# Altium schematic sheet LMR33630.SchDoc
size A; SheetNumber: 1; SheetTotal: 1
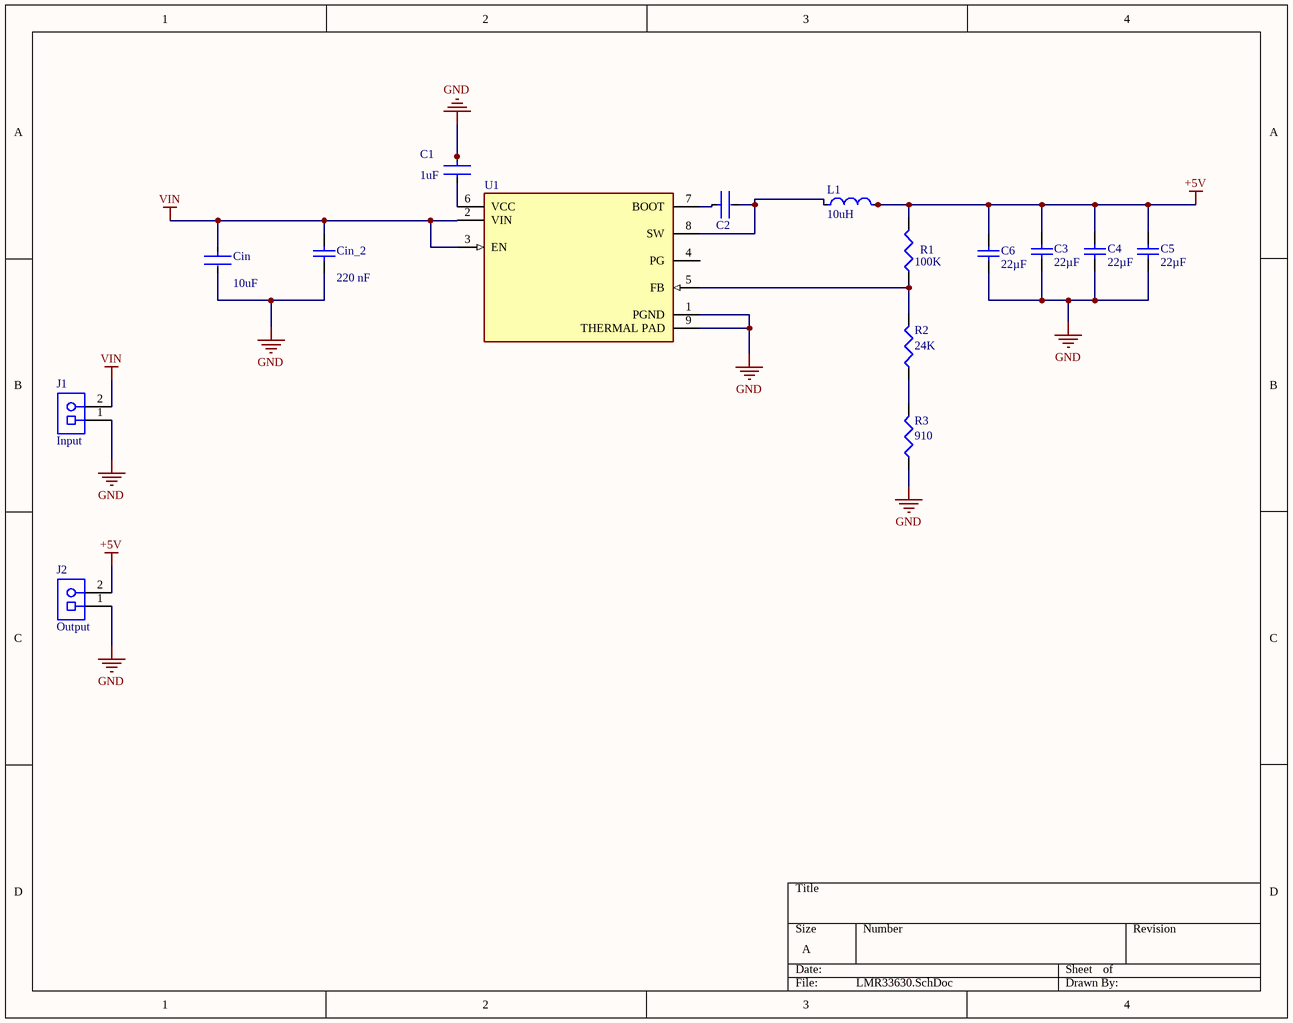
[diagram p0: LMR33630.SchDoc]

## Parts
C1  Capacitance: 1uF  [FP-CL31-IPC_B]  (hidden comment: CL31B105KBHNNNE)
C2  CC0603KRX7R9BB104  [FP-CC0603-DA-MFG]  (value not drawn)
C3  Capacitance: 22µF  [CAPC2013X140X45LL15T25]  (hidden comment: CL21A226MAQNNNE)
C4  Capacitance: 22µF  [CAPC2013X140X45LL15T25]  (hidden comment: CL21A226MAQNNNE)
C5  Capacitance: 22µF  [CAPC2013X140X45LL15T25]  (hidden comment: CL21A226MAQNNNE)
C6  Capacitance: 22µF  [CAPC2013X140X45LL15T25]  (hidden comment: CL21A226MAQNNNE)
Cin  value 10uF  [FP-CL31B106KBHNNNE-MFG]  (hidden comment: CL31B106KBHNNNE)
Cin_2  value 220 nF  [Cap_1206_220nF]  (hidden comment: 1206B224K500NT)
J1  Input  [PHOE-1729128-2_V]
J2  Output  [PHOE-1729128-2_V]
L1  Inductance: 10uH  [FP-IHLP-5050FD-FP_2_945x4-MFG]  (hidden comment: IHLP5050FDER100M01)
R1  value 100K  [J1-0603]  (hidden comment: 0603WAF1003T5E)
R2  value 24K  [Resistor_0603_910Ohm]  (hidden comment: 0603WAF2402T5E)
R3  value 910  [Resistor_0603_910Ohm]  (hidden comment: 0603WAF9100T5E)
U1  LMR33630ADDAR  [FP-DDA0008J-IPC_B]  (value not drawn)

## Nets
+5V: C3.2 C4.2 C5.2 C6.1 J2.2 L1.2 R1.2
GND: C1.1 C3.1 C4.1 C5.1 C6.2 Cin.2 Cin_2.1 J1.1 J2.1 R3.1 U1.1(PGND) U1.9(THERMAL_PAD)
VIN: Cin.1 Cin_2.2 J1.2 U1.2(VIN) U1.3(EN)
NetC1_2: C1.2 U1.6(VCC)
NetC2_1: C2.1 U1.7(BOOT)
NetC2_2: C2.2 L1.1 U1.8(SW)
NetR1_1: R1.1 R2.2 U1.5(FB)
NetR2_1: R2.1 R3.2

Not connected (* = marked no-connect by the designer): U1 4(PG)

## Library data of the parts
C1 = CMP-13271-001662-1: Cap Ceramic 1uF 50V X7R ±10% SMD 1206 +125°C Embossed T/R; Manufacturer: Samsung; Case Code (Metric): 3216; Packaging: Tape and Reel; Depth: 1.6mm; Max Operating Temperature: 125°C; Length: 3.2mm; Contact Plating: Tin; Voltage Rating (DC): 50V; Radiation Hardening: No; Min Operating Temperature: -55°C; Dielectric: X7R; Voltage: 50V; Lead Free: Lead Free; Package Quantity: 1; Material: Ceramic; Thickness: 0.071inch; Width: 0.063inch; Voltage Rating: 50V; Case Code (Imperial): 1206; Mount: Surface Mount; Case/Package: 1206; Tolerance: 10%; Height: 1.6mm; #LCSC: C1848; Manufacturer Part Number: CL31B105KBHNNNE
C2 = CMP-2100-03601-2: CAP CER 0.1UF 50V X7R 0603; Manufacturer: YAGEO; Material: Ceramic; Capacitance: 100 nF; Temperature Coefficient: 15%; Tolerance: 0.1; Value: 100 nF; Height: 0.9mm; Voltage: 50 V; ComponentLink2Description: Datasheet; Device Class L2: Capacitors; Temperature Range High: +125°C; Category: Cap; Footprint Url: http://www.yageo.com/exep/pages/download/literatures/UPY-C_GEN_24.pdf; ComponentLink2URL: http://www.yageo.com/documents/recent/UPY-GPHC_X7R_6.3V-to-50V_18.pdf; Package: CC0603-DA; Temperature: -55°C to +125°C; Voltage Rating: 50 V; Temperature Characteristic: X7R; Device Class L1: Passive Components; Temperature Range Low: -55°C; Manufacturer Part Number: CC0603KRX7R9BB104; RoHS: TRUE; Automotive: No; Device Class L3: Ceramic Capacitors; Octopart: https://octopart.com/cc0603krx7r9bb104-yageo-42244635; Mouser Description: Multilayer Ceramic Capacitor, CC Series, 0.1 - F, - 10%, X7R, 50 V, 0603 [1608 Metric]; Lead Free: Yes; Digikey Description: CAP CER 0.1UF 50V X7R 0603; #LCSC: C14663
C3-C6 = CMP-2000-06104-1: Multi-layer Ceramic Capacitor, 22 uF, -55 to 85 degC, 2-Pin SMD (0805), RoHS, Tape and Reel; Manufacturer: Samsung Electro-Mechanics; Voltage - Rated: 25V; Other Names: 1276-2908-2; Featured Product: Multi-LayerCeramicCapacitors; Product Training Modules: HighCapMLCCFamily; Temperature Coefficient: X5R; Tolerance: ±20%; Online Catalog: CLSeries,HighCapacitance; Applications: GeneralPurpose; RoHS Information: MLCCRoHS2Compliance; Height - Seated (Max): -; Lead Style: -; Lead Spacing: -; Datasheet URL: http://datasheet.octopart.com/CL21A226MAQNNNE-Samsung-datasheet-48647558.pdf; Size / Dimension: 0.079"Lx0.049"W(2.00mmx1.25mm); Thickness (Max): 0.055"(1.40mm); Family: CeramicCapacitors; Package Description: 2-Pin Surface Mount Device, Body 2.0 x 1.25 mm; Datasheet Version: 07/2015; Packaging: Tape&Reel(TR); Manufacturer URL: http://www.samsungsem.com/global/index.jsp; Ratings: -; Package / Case: 0805(2012Metric); Standard Package: 2,000; Mounting Type: SurfaceMount,MLCC; Mounting Technology: SurfaceMount; Category: Capacitors; Package Reference: 0805; Series: CL; Features: -; Operating Temperature: -55°C~85°C; #LCSC: C45783; Manufacturer Part Number: CL21A226MAQNNNE
Cin = CMP-2000-07530-2: CAP CER 10UF 50V X7R 1206; Manufacturer: Samsung; Tolerance: 10%; Temperature Coefficient: 15%; Temperature Characteristic: X7R; Digikey Description: CAP CER 10UF 50V X7R 1206; Device Class L1: Passive Components; Lead Free: Yes; Device Class L3: Ceramic Capacitors; Octopart: https://octopart.com/cl31b106kbhnnne-samsung-30507377; ComponentLink2URL: http://www.samsungsem.com/global/front/downloadcms.do?path=%2F%2Fglobal%2F%2Fsupport%2F%2Fproduct-search%2F%2Fmlcc%2F%2F__icsFiles%2F%2Fafieldfile%2F%2F2019%2F%2F06%2F%2F18&fileName=CL31B106KBHNNNE-19.pdf; Voltage Rating: 50V; Temperature Range Low: -55°C; RoHS: TRUE; Material: Ceramic; Temperature: -55°C to +125°C; Category: Cap; ComponentLink2Description: Datasheet; Manufacturer Part Number: CL31B106KBHNNNE; Automotive: No; Device Class L2: Capacitors; Capacitance: 10uF; Height: 1.8mm; Temperature Range High: +125°C; Package: CL31B106KBHNNNE; #LCSC: C89632
Cin_2 = Cap Semi: 220nF ±10% 50V X7R 1206 Multilayer Ceramic Capacitors MLCC - SMD/SMT RoHS; Manufacturer: FH(Guangdong Fenghua Advanced Tech); Published: 8-Jun-2000; LatestRevisionDate: 29-May-2009; LatestRevisionNote: IPC-7351 Footprint Added.; PackageReference: C1206; Publisher: Altium Limited; PackageDescription: Chip Capacitor; Manufacturer Part Number: 1206B224K500NT; #LCSC: C1857; Datasheet: https://datasheet.lcsc.com/szlcsc/1810311313_FH-Guangdong-Fenghua-Advanced-Tech-1206B224K500NT_C1857.pdf
J1 J2 = CMP-2000-05815-1: PCB Terminal Block, 13.5 A, 400 V, 2-Pin THD, RoHS, Bulk; PartNumber: 1729128; Manufacturer: Phoenix Contact; Package Version: 03/2015; No. of Rows: 1; Pitch: 5.08mm; No. of Positions: 2; Voltage Rating: 400V; Current Rating: 13500mA; Manufacturer URL: http://www.phoenixcontact.com/; Datasheet URL: https://datasheet.ciiva.com/16046/1729128-16046181.pdf; RoHS: TRUE; Package URL: https://www.phoenixcontact.com/online/portal/pi/pxc/product_detail_page/!ut/p/b1/3VdJjqNKFDxLH8AFycySyWY2ozFsEPOMMQaDOX1XedGL_1Vdm5YXJleknhSKeBkvI6EA8ncAo3AYoDhBQGco6KN7VURTdemj9us_IEKEZo_YHiPAEWEFmDGOHMORkqKYCORBZxgL7ZoaZYcbFFUZ3fqxSY6GOuxydWUuHqz1ynmMFygu583Bob0Ewr6Sd_l-5m-kAueHiB0jpRwZwe58wwtkpxtMYd_LmGcDRU02dRNEyWt6Y2ti5pSyJ_reIkzIulrqApdnbT11V5jnCKbYNCvhEM1MCpPByat_X379-iThf08CI5GfOPqfBeS3BRoBOdD55AKVv0iLwCMq-2BrzXWSGRH7pUGD9uwXQjiph3xL0DKQwdGa0JImiIOmBNOestqgwTHSSs2oOep-78apyXQBvNi8ZLaFjvjWvcaUEBu0MC6Wbe-d6mB0FAebo2lUWinqYaZs5DAYzV0RP9yitUjnGJ0iI9xhZkT42OCQNUJJhkgWINNQLP2JFP6OpMg3JCVg70jqHT0lvKOnhHf0lPuOnnLf0VPuWx6_dxwUIvwk5WMkT0kLL1mh61l2yZVSzG3pYV_bqo-mj6uMKwKwdnnW8Jh5RTOJzMOA5c-eJDaZQw4mTMPH02PvS_ZAqNVjVTo2WyYLkwH_KU1mmmG5kjRhDqPXLwwVHvVOjCM60-fpXvTDfMGW1PVFVS1r4e4yVDk4ZdNbkUHvqPqQSeian4UD39fNKmachqdJ1NJbyk8rXT9mXTvPk3oE5meulKGgiruPJek-4I9hTT6G8ZLOyRSm2RRVbThERQad5OS28hdt4YW4vG0stgYYzsWsK4_7y6DZMjJSCqri1kyiZR5vD7pwIrNR7QwPHTcLTI5qT7eRlpHrdGiupYlqQDJ7zy_CND8fWWBoLRXxk1RVcXiBQwbTD4Xi7KL-FuO94t9xaqweXzH; Package Description: 2-Pin Through Hole Device, Body 8.1 x 10.16 mm, Pitch 5.08 mm; Datasheet Version: 12/2013; Mounting Technology: ThroughHole; Orientation: Horizontal; Package Reference: 1729128-2; Packing: Bulk; #LCSC: C91153
L1 = CMP-02424-000485-1: FIXED IND 10UH 10A 17.2 MOHM SMD; Manufacturer: Vishay; Core Material: Metal; Self Resonant Frequency: 5MHz; Test Frequency: 100kHz; Shielding: Shielded; Max DC Current: 15.5A; DC Resistance (DCR): 17.2mR; Tolerance: 20%; Package Quantity: 250; Lead Free: Lead Free; RMS Current (Irms): 10A; Contact Plating: Tin; Max Operating Temperature: 125°C; Height - Seated (Max): 0.256inch; Case/Package: 5050; Military Standard: Not; Termination: SMD/SMT; Width: 0.508inch; Mount: Surface Mount; Number of Pins: 2; Packaging: Tape and Reel; Height: 6.5mm; Depth: 12.9mm; Radiation Hardening: No; Min Operating Temperature: -55°C; Length: 13.7mm; Current Rating: 10A; Inductance Tolerance: 20%; Saturation Current: 15.5A; Manufacturer Part Number: IHLP5050FDER100M01
R1 = Res3: 100kΩ ±1% 0.1W ±100ppm/℃ 0603 Chip Resistor - Surface Mount RoHS; Manufacturer: UNI-ROYAL(Uniroyal Elec); Published: 8-Jun-2000; LatestRevisionDate: 29-May-2009; LatestRevisionNote: IPC-7351 Footprint Added.; PackageReference: J1-0603; Publisher: Altium Limited; PackageDescription: Chip Resistor; #LCSC: C25803; Manufacturer Part Number: 0603WAF1003T5E
R2 = Res3: 24kΩ ±1% 0.1W ±100ppm/℃ 0603 Chip Resistor - Surface Mount RoHS; Manufacturer: UNI-ROYAL(Uniroyal Elec); Published: 8-Jun-2000; LatestRevisionDate: 29-May-2009; LatestRevisionNote: IPC-7351 Footprint Added.; PackageReference: J1-0603; Publisher: Altium Limited; PackageDescription: Chip Resistor; #LCSC: C23352; Manufacturer Part Number: 0603WAF2402T5E
R3 = Res3: 910Ω ±1% 0.1W ±100ppm/℃ 0603 Chip Resistor - Surface Mount RoHS; Manufacturer: UNI-ROYAL(Uniroyal Elec); Published: 8-Jun-2000; LatestRevisionDate: 29-May-2009; LatestRevisionNote: IPC-7351 Footprint Added.; PackageReference: J1-0603; Publisher: Altium Limited; PackageDescription: Chip Resistor; #LCSC: C23264; Manufacturer Part Number: 0603WAF9100T5E
U1 = CMP-04918-000184-1: IC REG BUCK ADJUSTABLE 3A 8SOPWR; Manufacturer: Texas Instruments; Switching Frequency: 400kHz; Number of Outputs: 1; Output Configuration: Positive; Synchronous Rectifier: Yes; Min Output Voltage: 1V; Max Output Voltage: 24V; Max Input Voltage: 36V; Min Input Voltage: 3.8V; Output Current: 3A; Min Operating Temperature: -40°C; Max Operating Temperature: 125°C; Number of Pins: 8; RoHS Compliant: Yes; Mount: Surface Mount; Output Type: Adjustable; Packaging: Cut Tape; #LCSC: C841384; Manufacturer Part Number: LMR33630ADDAR